# EAGLE design mainbrd (EAGLE 5.06)
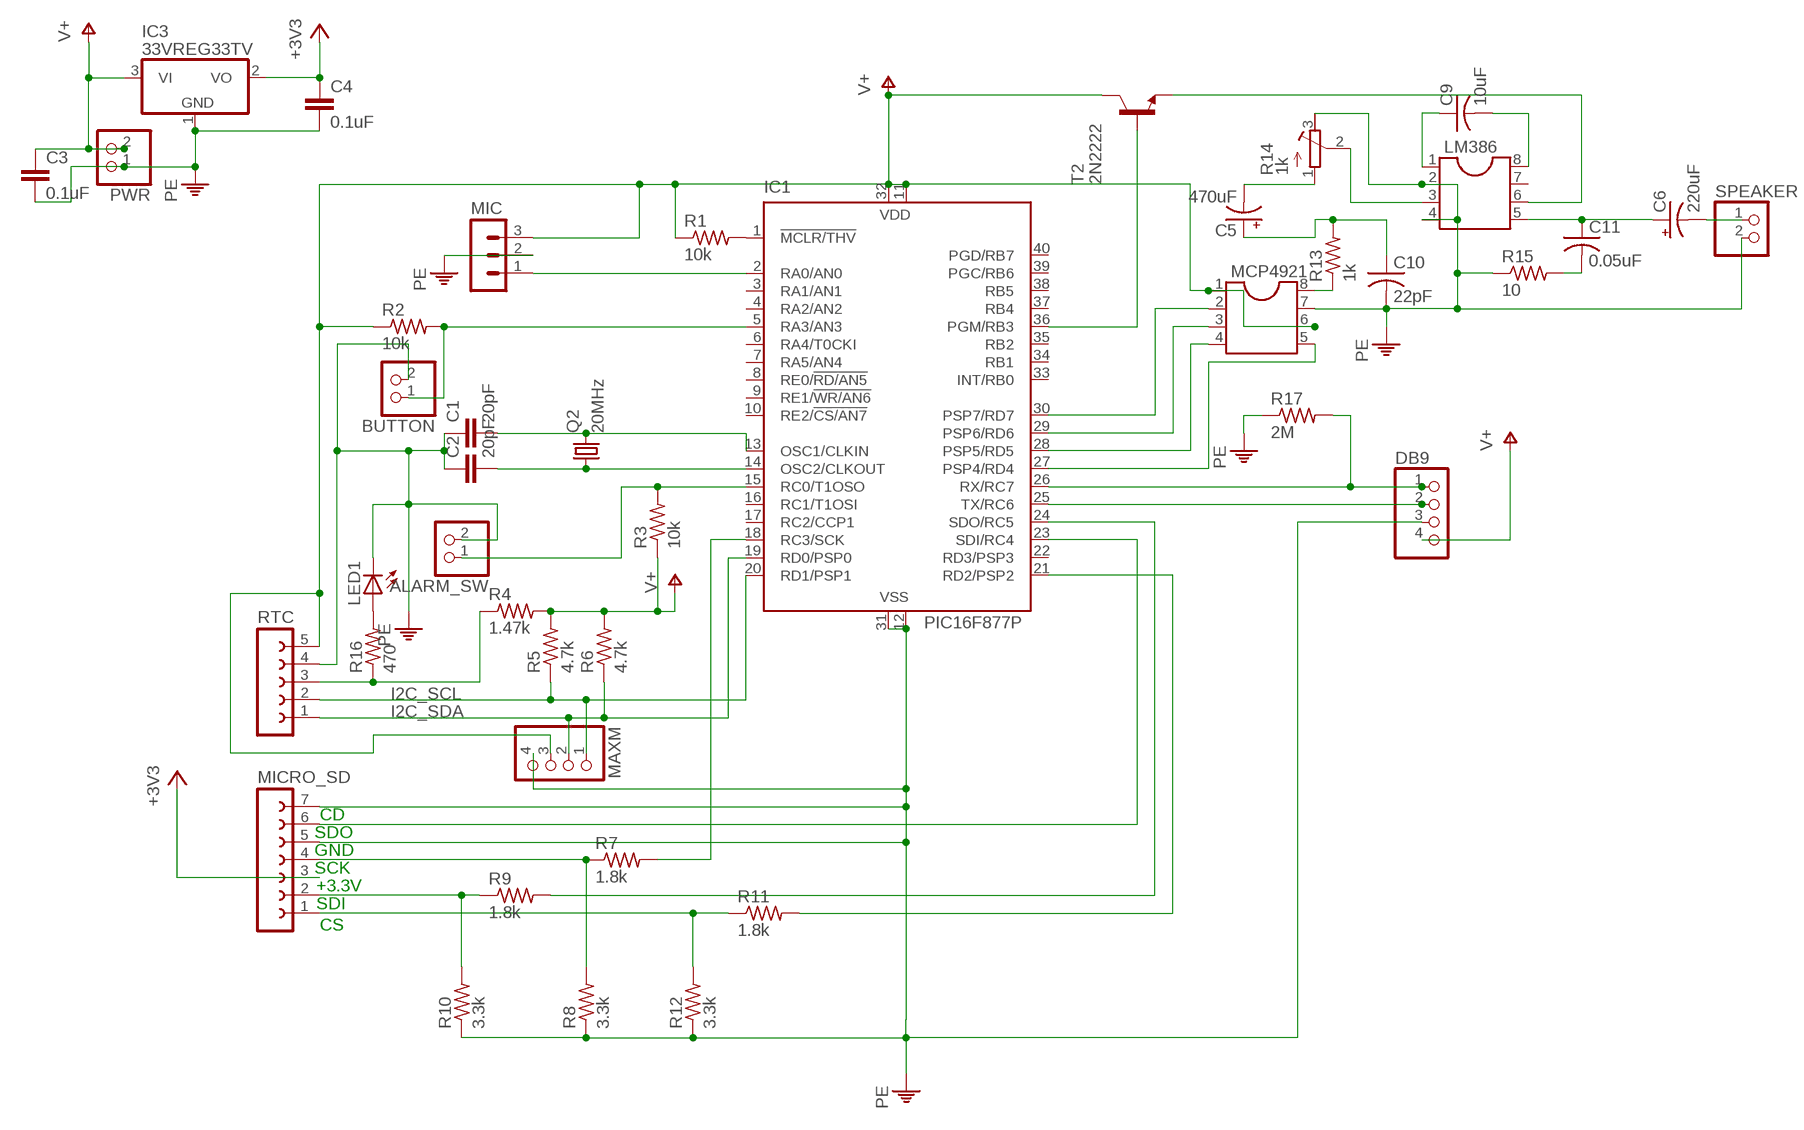
[diagram p0: schematic, sheet 1]

## Parts
ALARM_SW  PINHD-1X2  [1X02]
BUTTON  PINHD-1X2  [1X02]
C1  20pF  C5/2.5  [C5B2.5]
C2  20pF  C5/2.5  [C5B2.5]
C3  0.1uF  C-EU025-025X050  [C025-025X050]
C4  0.1uF  C5/2.5  [C5B2.5]
C5  470uF  CPOL-USB45181B  [B45181B]
C6  220uF  CPOL-USE5-10.5  [E5-10,5]
C9  10uF  C-US050-024X044  [C050-024X044]
C10  22pF  C-US025-025X050  [C025-025X050]
C11  0.05uF  C-US025-025X050  [C025-025X050]
DB9  PINHD-1X4  [1X04]
IC1  PIC16F877P  [DIL40]
IC3  33VREG33TV  [TO220V]
LED1  LED3MM  [LED3MM]
LM386  DIL8S  [SOCKET-08]
MAXM  PINHD-1X4  [1X04]
MCP4921  DIL8S  [SOCKET-08]
MIC  MA03-1  [MA03-1]
MICRO_SD  FE07-1  [FE07]
PWR  PINHD-1X2  [1X02]
Q2  20MHz  CRYSTALHC18U-V  [HC18U-V]
R1  10k  R-US_0204/7  [0204/7]
R2  10k  R-US_0204/7  [0204/7]
R3  10k  R-US_0204/7  [0204/7]
R4  1.47k  R-US_0204/7  [0204/7]
R5  4.7k  R-US_0204/7  [0204/7]
R6  4.7k  R-US_0204/7  [0204/7]
R7  1.8k  R-US_0204/7  [0204/7]
R8  3.3k  R-US_0204/7  [0204/7]
R9  1.8k  R-US_0204/7  [0204/7]
R10  3.3k  R-US_0204/7  [0204/7]
R11  1.8k  R-US_0204/7  [0204/7]
R12  3.3k  R-US_0204/7  [0204/7]
R13  1k  R-US_0204/7  [0204/7]
R14  1k  R-TRIMM64W  [RTRIM64W]
R15  10  R-US_0204/7  [0204/7]
R16  470  R-US_0204/7  [0204/7]
R17  2M  R-US_0204/7  [0204/7]
RTC  FE05-1  [FE05-1]
SPEAKER  PINHD-1X2  [1X02]
T2  2N2222  [TO18]

## Nets
+3V3: C4.1 IC3.2(VO) MICRO_SD.3
CS_3V: MICRO_SD.1 R11.1 R12.2
CS_5V: IC1.21(RD2/PSP2) R11.2
GND: ALARM_SW.2 BUTTON.2 C1.1 C2.1 C3.2 C4.2 DB9.3 IC1.12(VSS) IC1.31(VSS) IC3.1(GND) LED1.K(C) MAXM.4 MIC.2 MICRO_SD.5 MICRO_SD.7 PWR.1 R8.1 R10.1 R12.1 RTC.4 ; supply symbol labelled PE
I2C_SCL: IC1.20(RD1/PSP1) MAXM.1 R5.1 RTC.2
I2C_SDA: IC1.19(RD0/PSP0) MAXM.2 R6.1 RTC.1
N$1: IC1.1(!MCLR/THV) R1.2
N$2: R4.1 R16.1 RTC.3
N$3: IC1.27(PSP4/RD4) MCP4921.5
N$4: IC1.2(RA0/AN0) MIC.1
N$5: ALARM_SW.1 IC1.15(RC0/T1OSO) R3.2
N$6: BUTTON.1 IC1.5(RA3/AN3) R2.2
N$7: DB9.1 IC1.26(RX/RC7) R17.2
N$8: C1.2 IC1.13(OSC1/CLKIN) Q2.2
N$9: DB9.2 IC1.25(TX/RC6)
N$10: C2.2 IC1.14(OSC2/CLKOUT) Q2.1
N$12: C11.2 R15.2
N$17: C6.- SPEAKER.1
N$18: C5.- R14.1(E)
N$19: C9.1 LM386.1
N$20: LM386.3 R14.2(S)
N$21: LED1.A R16.2
N$22: LM386.6 T2.1(E)
N$23: MCP4921.8 R13.1
N$32: C9.2 LM386.8
N$33: C5.+ C10.1 R13.2
N$34: IC1.30(PSP7/RD7) MCP4921.2
N$35: IC1.29(PSP6/RD6) MCP4921.3
N$36: IC1.28(PSP5/RD5) MCP4921.4
N$39: IC1.36(PGM/RB3) T2.2(B)
N$42: C6.+ C11.1 LM386.5
PE: C10.2 LM386.2 LM386.4 MCP4921.7 R14.3(A) R15.1 R17.1 SPEAKER.2
SCK_3V: MICRO_SD.4 R7.1 R8.2
SCK_5V: IC1.18(RC3/SCK) R7.2
SDI_3V: MICRO_SD.2 R9.1 R10.2
SDI_5V: IC1.23(SDI/RC4) MICRO_SD.6
SDO_5V: IC1.24(SDO/RC5) R9.2
V+: C3.1 DB9.4 IC1.11(VDD) IC1.32(VDD) IC3.3(VI) MAXM.3 MCP4921.1 MCP4921.6 MIC.3 PWR.2 R1.1 R2.1 R3.1 R4.2 R5.2 R6.2 RTC.5 T2.3(C)
Unconnected: IC1.3(RA1/AN1) IC1.4(RA2/AN2) IC1.6(RA4/T0CKI) IC1.7(RA5/AN4) IC1.8(RE0/!RD/AN5) IC1.9(RE1/!WR/AN6) IC1.10(RE2/!CS/AN7) IC1.16(RC1/T1OSI) IC1.17(RC2/CCP1) IC1.22(RD3/PSP3) IC1.33(INT/RB0) IC1.34(RB1) IC1.35(RB2) IC1.37(RB4) IC1.38(RB5) IC1.39(PGC/RB6) IC1.40(PGD/RB7) LM386.7

## Notes on the sheet
- CD
- SDO
- GND
- SCK
- +3.3V
- SDI
- CS

## Library data of the parts
ALARM_SW BUTTON PWR SPEAKER = pinhead:PINHD-1X2: PIN HEADER
C1 C2 C4 = capacitor-wima:C: CAPACITOR naming: grid - package width
C3 = resistor:C-EU: CAPACITOR, European symbol
C5 C6 = resistor:CPOL-US: POLARIZED CAPACITOR, American symbol
C9 = resistor:C-US: CAPACITOR, American symbol
C10 C11 = rcl:C-US: CAPACITOR, American symbol
DB9 MAXM = pinhead:PINHD-1X4: PIN HEADER
IC1 = microchip:PIC16F87*: MICROCONTROLLER
IC3 = jorjs_parts:33VREG: 3.3v positive regulator LV33, as from SparkFun.com. Note the different pinout than the 78* series!
LED1 = led:LED: LED OSRAM: - CHIPLED LG R971, LG N971, LY N971, LG Q971, LY Q971, LO R971, LY R971 LH N974, LH R974 LS Q976, LO Q976, LY Q976 LO Q996 - Hyper CHIPLED LW Q18S LB Q993, LB Q99A, LB R99A - SideLED LS A670, LO A670, LY A670, LG A670, LP A670 LB A673, LV A673, LT A673, LW A673 LH A674 LY A675 LS A676, LA A676, LO A676, LY A676, LW A676 LS A679, LY A679, LG A679 - Hyper Micro SIDELED® LS Y876, LA Y876, LO Y876, LY Y876 LT Y87S - SmartLED LW L88C, LW L88S LB L89C, LB L89S, LG L890 LS L89K, LO L89K, LY L89K LS L896, LA L896, LO L896, LY L896 - TOPLED LS T670, LO T670, LY T670, LG T670, LP T670 LSG T670, LSP T670, LSY T670, LOP T670, LYG T670 LG T671, LOG T671, LSG T671 LB T673, LV T673, LT T673, LW T673 LH T674 LS T676, LA T676, LO T676, LY T676, LB T676, LH T676, LSB T676, LW T676 LB T67C, LV T67C, LT T67C, LS T67K, LO T67K, LY T67K, LW E67C LS E67B, LA E67B, LO E67B, LY E67B, LB E67C, LV E67C, LT E67C LW T67C LS T679, LY T679, LG T679 LS T770, LO T770, LY T770, LG T770, LP T770 LB T773, LV T773, LT T773, LW T773 LH T774 LS E675, LA E675, LY E675, LS T675 LS T776, LA T776, LO T776, LY T776, LB T776 LHGB T686 LT T68C, LB T68C - Hyper Mini TOPLED® LB M676 - Mini TOPLED Santana® LG M470 LS M47K, LO M47K, LY M47K Source: http://www.osram.convergy.de LUXEON: - LUMILED® LXK2-PW12-R00, LXK2-PW12-S00, LXK2-PW14-U00, LXK2-PW14-V00 LXK2-PM12-R00, LXK2-PM12-S00, LXK2-PM14-U00 LXK2-PE12-Q00, LXK2-PE12-R00, LXK2-PE12-S00, LXK2-PE14-T00, LXK2-PE14-U00 LXK2-PB12-K00, LXK2-PB12-L00, LXK2-PB12-M00, LXK2-PB14-N00, LXK2-PB14-P00, LXK2-PB14-Q00 LXK2-PR12-L00, LXK2-PR12-M00, LXK2-PR14-Q00, LXK2-PR14-R00 LXK2-PD12-Q00, LXK2-PD12-R00, LXK2-PD12-S00 LXK2-PH12-R00, LXK2-PH12-S00 LXK2-PL12-P00, LXK2-PL12-Q00, LXK2-PL12-R00 Source: www.luxeon.com KINGBRIGHT: KA-3528ASYC Source: www.kingbright.com
LM386 MCP4921 = ic-package:DIL8: Dual In Line / Socket
MIC = con-lstb:MA03-1: PIN HEADER
MICRO_SD = con-lsta:FE07-1: FEMALE HEADER
Q2 = crystal:CRYSTAL: CRYSTAL
R1-R13 R15-R17 = rcl:R-US_: RESISTOR, American symbol
R14 = rcl:R-TRIMM: Trimm resistor
RTC = con-lsta:FE05-1: FEMALE HEADER
T2 = transistor-neu-to92:2N2222: NPN TRANSISTOR

## Board
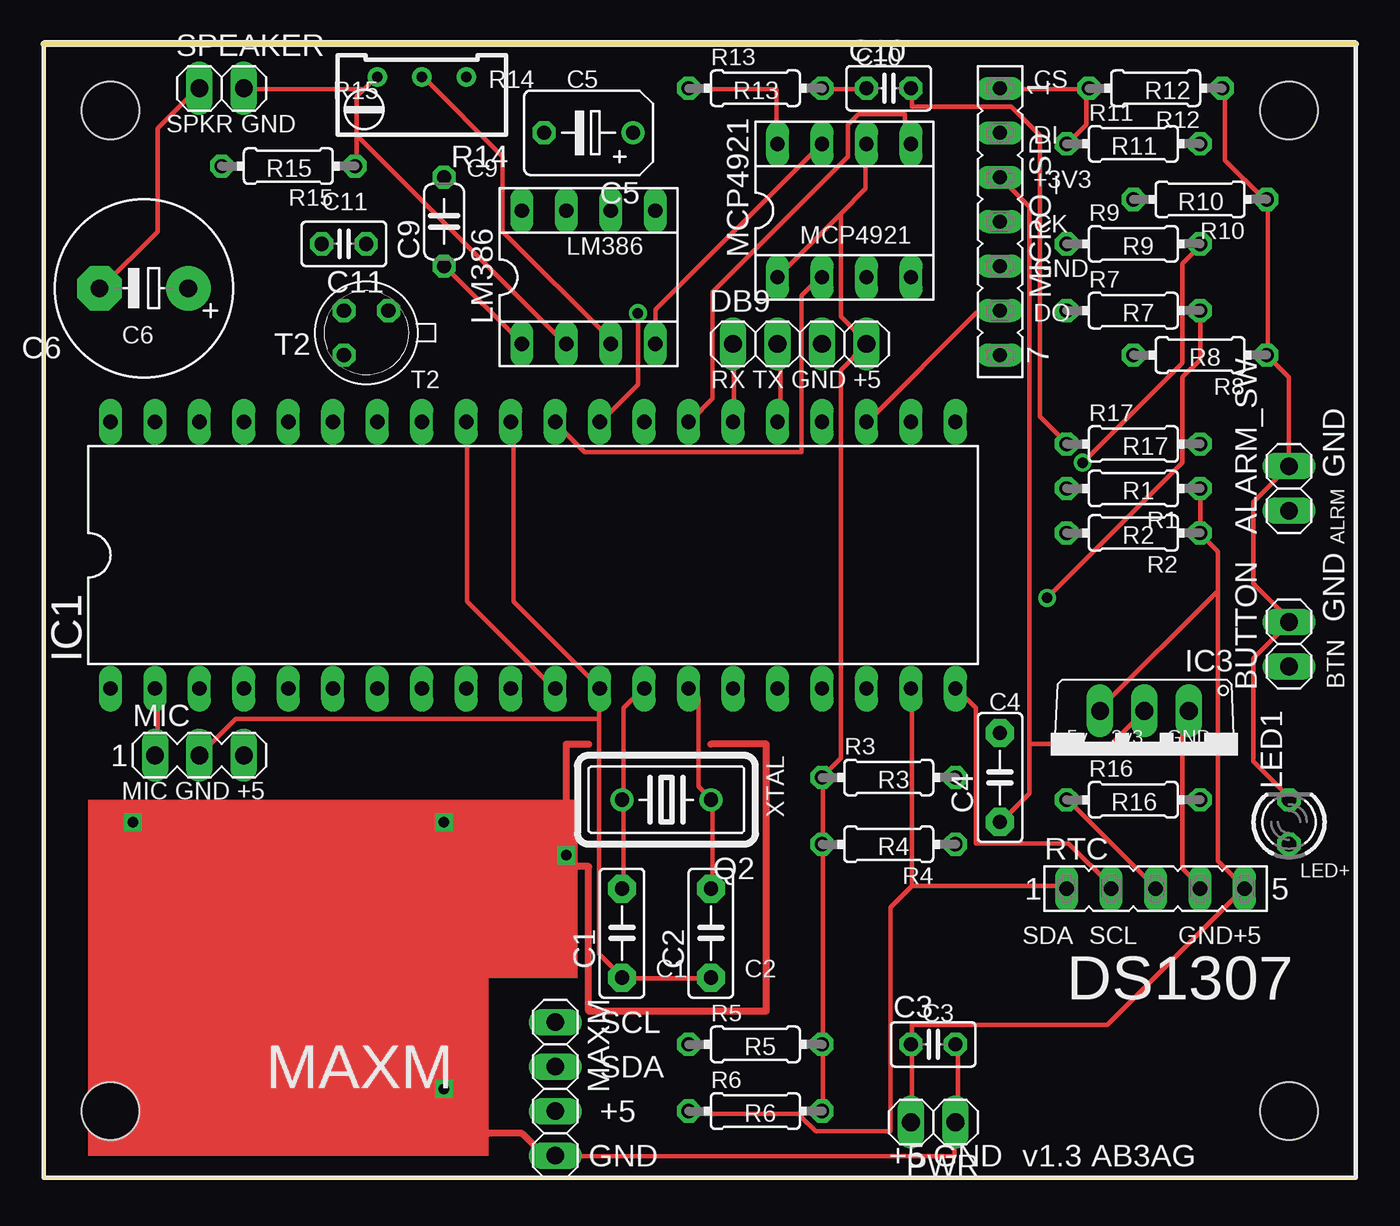
[diagram p1: board, top side]
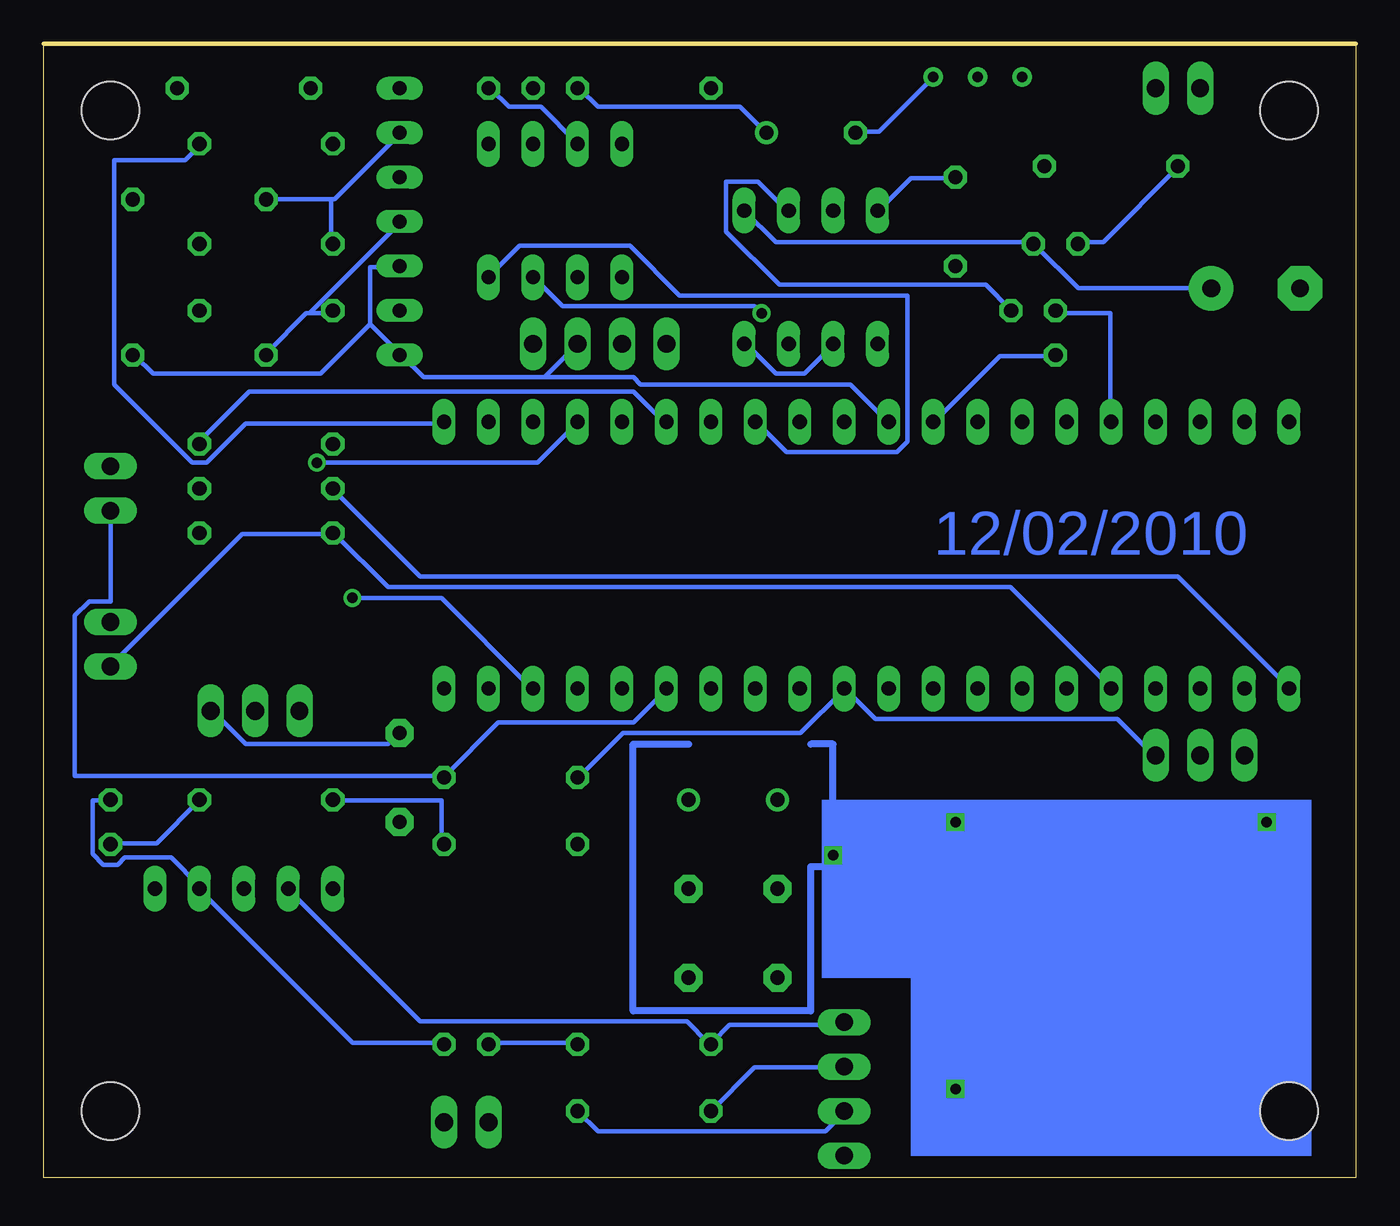
[diagram p2: board, bottom side, seen from below]

Size 74.93 x 64.77 mm. Coordinates in mm from the lower left corner, seen from the top.
Outline: 0,0 74.93,0 74.93,64.77 0,64.77 0,0
Copper layers (1*16): Top 0.035mm / dielectric 1.5mm / Bottom 0.035mm
Design rules "default": minimum track width 10mil, minimum drill 24mil, track to track 8mil, track to pad 8mil, pad to pad 8mil, via to via 8mil, smd to smd 8mil, copper to edge 40mil, drill to drill 8mil, minimum pad ring 10mil, minimum via ring 8mil, stop-mask expansion 4mil, vias tented up to drill 0mil, thermal gap 10mil

### Footprints (pad centres in the part's own frame; a part is rotated, then mirrored left to right if it is on the bottom)
1X02 = drill 1.016 long: 1 -1.27,0; 2 1.27,0
C5B2.5 = drill 0.813 pad 1.6 octagon: 1 -2.54,0; 2 2.54,0
C025-025X050 = drill 0.813 octagon: 1 -1.27,0; 2 1.27,0
B45181B = drill 0.813 round: + -2.54,0 | drill 0.813 octagon: - 2.54,0
E5-10,5 = drill 1.016 pad 2.54 round: + -2.54,0 | drill 1.016 pad 2.54 octagon: - 2.54,0
C050-024X044 = drill 0.813 octagon: 1 -2.54,0; 2 2.54,0
1X04 = drill 1.016 long: 1 -3.81,0; 2 -1.27,0; 3 1.27,0; 4 3.81,0
DIL40 = drill 0.813 long: 1 -24.13,-7.62; 2 -21.59,-7.62; 3 -19.05,-7.62; 4 -16.51,-7.62; 5 -13.97,-7.62; 6 -11.43,-7.62; 7 -8.89,-7.62; 8 -6.35,-7.62; 9 -3.81,-7.62; 10 -1.27,-7.62; 11 1.27,-7.62; 12 3.81,-7.62; 13 6.35,-7.62; 14 8.89,-7.62; 15 11.43,-7.62; 16 13.97,-7.62; 17 16.51,-7.62; 18 19.05,-7.62; 19 21.59,-7.62; 20 24.13,-7.62; 21 24.13,7.62; 22 21.59,7.62; 23 19.05,7.62; 24 16.51,7.62; 25 13.97,7.62; 26 11.43,7.62; 27 8.89,7.62; 28 6.35,7.62; 29 3.81,7.62; 30 1.27,7.62; 31 -1.27,7.62; 32 -3.81,7.62; 33 -6.35,7.62; 34 -8.89,7.62; 35 -11.43,7.62; 36 -13.97,7.62; 37 -16.51,7.62; 38 -19.05,7.62; 39 -21.59,7.62; 40 -24.13,7.62
TO220V = drill 1.016 long: 1 -2.54,-2.54; 2 0,-2.54; 3 2.54,-2.54
LED3MM = drill 0.813 octagon: A -1.27,0; K 1.27,0
SOCKET-08 = drill 0.813 long: 1 -3.81,-3.81; 2 -1.27,-3.81; 3 1.27,-3.81; 4 3.81,-3.81; 5 3.81,3.81; 6 1.27,3.81; 7 -1.27,3.81; 8 -3.81,3.81
MA03-1 = drill 1.016 long: 1 -2.54,0; 2 0,0; 3 2.54,0
FE07 = drill 0.813 long: 1 -7.62,0; 2 -5.08,0; 3 -2.54,0; 4 0,0; 5 2.54,0; 6 5.08,0; 7 7.62,0
HC18U-V = drill 0.813 round: 1 -2.54,0; 2 2.54,0
0204/7 = drill 0.813 octagon: 1 -3.81,0; 2 3.81,0
RTRIM64W = drill 0.61 round: 1 1.27,-2.54; 2 1.27,0; 3 1.27,2.54
FE05-1 = drill 0.813 long: 1 -5.08,0; 2 -2.54,0; 3 0,0; 4 2.54,0; 5 5.08,0
TO18 = drill 0.813 octagon: 1 -1.27,-1.27; 2 1.27,-1.27; 3 1.27,1.27
STAND-OFF = hole 3.302: 0,0

### Placement (x,y rotation side)
ALARM_SW  71.12,39.37 90 top
BUTTON  71.12,30.48 90 top
C1  33.02,13.97 90 top
C2  38.1,13.97 90 top
C3  50.8,7.62 0 top
C4  54.61,22.86 90 top
C5  31.11,59.69 180 top
C6  5.71,50.8 180 top
C9  22.86,54.61 90 top
C10  48.26,62.23 0 top
C11  17.14,53.34 180 top
DB9  43.18,47.62 0 top
IC1  27.94,35.56 0 top
IC3  62.87,24.13 180 top
LED1  71.12,20.32 90 top
LM386  31.11,51.44 0 top
MAXM  29.21,5.08 270 top
MCP4921  45.72,55.24 0 top
MIC  8.89,24.13 0 top
MICRO_SD  54.61,54.61 270 top
PWR  50.8,3.17 180 top
Q2  35.56,21.59 180 top
R1  62.23,39.37 180 top
R2  62.23,36.83 180 top
R3  48.26,22.86 0 top
R4  48.26,19.05 180 top
R5  40.64,7.62 0 top
R6  40.64,3.81 0 top
R7  62.23,49.53 0 top
R8  66.04,46.99 180 top
R9  62.23,53.34 0 top
R10  66.04,55.88 180 top
R11  62.23,59.05 0 top
R12  63.5,62.23 180 top
R13  40.64,62.23 0 top
R14  21.59,61.59 90 top
R15  13.97,57.78 180 top
R16  62.23,21.59 0 top
R17  62.23,41.91 0 top
RTC  63.5,16.51 0 top
SPEAKER  10.16,62.23 0 top
T2  18.41,48.26 180 top
U$1  [STAND-OFF]  71.12,3.81 0 top
U$2  [STAND-OFF]  3.81,3.81 0 top
U$3  [STAND-OFF]  3.81,60.96 0 top
U$4  [STAND-OFF]  71.12,60.96 0 top

### Tracks (layer width: path | path; a pad name or v marks a point on that pad's centre or on a via)
+3V3
  Top 0.254: 56.29,24.79 56.29,21.95 54.66,20.32 C4.1 | 56.29,24.79 56.29,55.47 MICRO_SD.3 | 56.29,24.79 60.96,24.79 62.79,26.62 IC3.2
CS_3V
  Top 0.254: 59.54,62.18 59.54,60.15 58.52,59.13 R11.1 | 59.54,62.18 54.66,62.18 MICRO_SD.1 | 59.54,62.18 R12.2
CS_5V
  Bottom 0.254: IC1.21 52.22,43.08 63.4,43.08 65.63,40.84 66.45,40.84 70.92,45.31 70.92,58.12 66.85,58.12 66.04,58.93 R11.2
GND
  Top 0.254: RTC.4 66.04,16.66 65.02,17.68 65.02,26.42 65.23,26.62 IC3.1 | C3.2 52.22,7.52 52.22,3.25 PWR.1 52.02,3.05 52.02,1.22 29.26,1.22 MAXM.4 | C2.1 38,11.38 33.12,11.38 C1.1 32.92,11.58 31.7,12.8 31.7,26.21 | IC1.31 26.82,43.08 26.82,32.92 31.7,28.04 IC1.12 31.7,27.84 31.7,26.21 | 31.7,26.21 10.97,26.21 MIC.2 | LED1.K 71.12,21.74 69.09,23.77 69.09,29.67 71.12,31.7 BUTTON.2 71.12,31.9 69.09,33.93 69.09,38.61 ALARM_SW.2 71.12,45.72 R8.1 69.9,47.14 69.9,55.88 R10.1 69.7,55.88 67.46,58.12 67.46,62.18 R12.1
  Bottom 0.254: C4.2 54.66,25.4 55.27,24.79 63.4,24.79 65.23,26.62 IC3.1 | C3.2 52.22,7.72 57.3,7.72 66.04,16.46 RTC.4 66.04,16.66 67.67,18.29 70.31,18.29 70.71,17.88 71.53,17.88 72.14,18.49 72.14,21.54 71.12,21.54 LED1.K | 56.29,48.77 54.66,47.14 MICRO_SD.7 54.46,46.94 53.24,45.72 46.33,45.72 | 56.29,48.77 56.29,52.02 54.66,52.02 MICRO_SD.5 | 46.33,45.72 44.5,47.55 DB9.3 | 56.29,48.77 59.13,45.92 68.68,45.92 69.7,46.94 R8.1 | 46.33,45.72 41.25,45.72 40.84,45.31 28.85,45.31 26.82,43.28 IC1.31
I2C_SCL
  Top 0.254: RTC.2 60.96,16.66 58.52,19.1 53.24,19.1 53.24,26.82 52.22,27.84 IC1.20
  Bottom 0.254: MAXM.1 29.26,8.74 35.76,8.74 36.78,7.72 R5.1 36.98,7.72 38.2,8.94 53.44,8.94 60.96,16.46 RTC.2
I2C_SDA
  Top 0.254: 49.58,16.66 58.32,16.66 RTC.1 | 49.58,16.66 49.58,27.84 IC1.19 | 49.58,16.66 48.36,15.44 48.36,2.64 44.09,2.64 43.28,3.45 43.28,3.66 36.98,3.66 R6.1
  Bottom 0.254: R6.1 34.34,6.3 29.26,6.3 MAXM.2
N$1
  Bottom 0.254: IC1.1 3.86,28.04 10.16,34.34 53.44,34.34 58.32,39.22 R1.2
N$2
  Top 0.254: RTC.3 63.4,16.66 58.52,21.54 R16.1
  Bottom 0.254: R4.1 52.22,19.1 52.22,21.54 58.32,21.54 R16.1
N$3
  Top 0.254: IC1.27 36.98,43.28 38.2,44.5 38.2,50.6 45.92,58.32 45.92,60.15 46.53,60.76 49.17,60.76 49.17,59.33 49.38,59.13 MCP4921.5
N$4
  Top 0.254: IC1.2 6.5,27.84 6.5,24.18 MIC.1
N$5
  Bottom 0.254: IC1.15 39.42,27.84 41.25,26.01 48.97,26.01 52.02,22.96 R3.2 52.22,22.96 73.15,22.96 73.15,32.11 72.34,32.92 71.12,32.92 ALARM_SW.1
N$6
  Bottom 0.254: IC1.5 14.02,28.04 19.71,33.73 55.27,33.73 58.32,36.78 R2.2 58.52,36.78 63.6,36.78 71.12,29.26 BUTTON.1
N$7
  Top 0.254: DB9.1 39.42,47.55 39.42,43.28 IC1.26
  Bottom 0.254: R17.2 66.04,42.06 63.2,44.91 41.25,44.91 39.62,43.28 39.42,43.28 IC1.26
N$8
  Top 0.254: C1.2 33.12,16.66 33.12,21.54 Q2.2 33.12,21.74 33.12,26.82 34.14,27.84 IC1.13
N$9
  Top 0.254: IC1.25 42.06,43.28 42.06,47.55 DB9.2
N$10
  Top 0.254: C2.2 38.2,16.66 38.2,21.54 Q2.1 38,21.74 37.39,22.35 37.39,27.43 36.98,27.84 IC1.14
N$12
  Bottom 0.254: R15.2 10.16,57.71 14.43,53.44 15.85,53.44 C11.2
N$13
  Top 0.406: 25.4,2.54 27.3,2.54 28.57,1.27
N$14  (via drill 0.6)
  other vias: 5.08,20.32
N$15  (via drill 0.6)
  other vias: 22.86,20.32
N$16  (via drill 0.6)
  other vias: 22.86,5.08
N$17
  Top 0.254: SPEAKER.1 8.74,62.18 6.5,59.94 6.5,54.05 3.25,50.8 C6.-
N$18
  Bottom 0.254: R14.1 24.18,62.79 27.23,59.74 28.45,59.74 C5.-
N$19
  Top 0.254: LM386.1 27.23,47.75 22.96,52.02 C9.1
N$20
  Top 0.254: R14.2 21.74,62.79 26.21,58.32 26.21,54.05 32.31,47.95 32.31,47.75 LM386.3
N$21
  Bottom 0.254: R16.2 66.04,21.54 68.48,19.1 71.12,19.1 LED1.A
N$22
  Bottom 0.254: T2.1 19.71,49.58 21.13,51 32.92,51 35.97,54.05 35.97,56.9 34.14,56.9 32.51,55.27 LM386.6
N$23
  Top 0.254: R13.1 36.98,62.18 41.86,62.18 41.86,59.13 MCP4921.8
N$25
  Top 0.406: 30.48,17.78 31.11,17.78 31.11,9.53 41.27,9.53 41.27,24.77 38.1,24.77
N$26
  Bottom 0.406: 29.84,17.78 31.11,17.78 31.11,9.53 41.27,9.53 41.27,24.77 38.1,24.77
N$27  (via drill 0.6)
  Top 0.406: 29.84,17.78 v29.84,18.41 29.84,24.77 31.11,24.77
  Bottom 0.406: 31.11,24.77 29.84,24.77 v29.84,18.41
N$32
  Bottom 0.254: LM386.8 27.23,55.27 25.4,57.1 22.96,57.1 C9.2
N$33
  Top 0.254: C10.1 46.94,62.18 44.5,62.18 R13.2
  Bottom 0.254: C5.+ 33.73,59.74 35.15,61.16 43.28,61.16 44.3,62.18 R13.2
N$34
  Top 0.254: IC1.30 29.26,43.08 30.89,41.45 43.28,41.45 43.28,50.39 44.3,51.41 MCP4921.2
N$35  (via drill 0.61)
  Top 0.254: v33.93,49.38 33.93,45.31 31.9,43.28 IC1.29
  Bottom 0.254: v33.93,49.38 34.34,49.78 45.31,49.78 46.94,51.41 MCP4921.3
N$36
  Bottom 0.254: IC1.28 34.14,43.08 32.51,41.45 26.21,41.45 25.6,42.06 25.6,50.39 38.61,50.39 41.45,53.24 47.75,53.24 49.38,51.61 MCP4921.4
N$39
  Bottom 0.254: IC1.36 14.02,43.28 14.02,49.38 17.07,49.38 T2.2
N$42
  Bottom 0.254: C6.+ 15.85,50.8 18.29,53.24 C11.1 18.49,53.44 33.12,53.44 LM386.5
PE
  Top 0.254: R17.1 58.32,42.06 56.9,43.48 56.9,59.54 55.27,61.16 49.58,61.16 49.58,62.18 C10.2 | 18.29,62.18 17.88,61.77 17.88,59.54 | 18.29,62.18 18.9,62.79 R14.3 | 17.88,59.54 17.88,57.91 R15.1 | 18.29,62.18 11.58,62.18 SPEAKER.2 | 17.88,59.54 29.67,47.75 LM386.2 | MCP4921.7 44.3,58.93 34.95,49.58 34.95,47.75 LM386.4
  Bottom 0.254: MCP4921.7 44.5,59.13 46.53,61.16 48.36,61.16 49.38,62.18 C10.2 | LM386.2 29.87,47.55 31.5,45.92 33.12,45.92 34.75,47.55 LM386.4
SCK_3V
  Bottom 0.254: 59.74,49.38 58.52,49.38 R7.1 | 59.74,49.38 59.94,49.38 62.18,47.14 R8.2 | 59.74,49.38 54.66,54.46 MICRO_SD.4
SCK_5V  (via drill 0.61)
  Top 0.254: v57.3,33.12 65.02,40.84 65.02,45.72 66.04,46.74 R7.2
  Bottom 0.254: v57.3,33.12 52.22,33.12 47.14,28.04 IC1.18
SDI_3V
  Bottom 0.254: 58.52,55.88 58.32,55.88 54.66,59.54 MICRO_SD.2 | 58.52,55.88 R10.2 | 58.52,55.88 58.52,53.44 R9.1
SDI_5V
  Top 0.254: IC1.23 47.14,43.28 53.24,49.38 54.46,49.38 MICRO_SD.6
SDO_5V  (via drill 0.61)
  Top 0.254: v59.33,40.84 65.02,46.53 65.02,52.22 66.04,53.24 R9.2
  Bottom 0.254: v59.33,40.84 46.74,40.84 44.5,43.08 IC1.24
V+
  Top 0.254: IC1.11 29.06,28.04 24.18,32.92 24.18,43.08 IC1.32 | R1.1 R2.1 66.04,36.78 67.06,35.76 67.06,33.53 | 67.06,33.53 67.06,18.09 68.48,16.66 RTC.5 68.48,16.46 60.76,8.74 49.58,8.74 49.58,7.72 C3.1 49.58,7.52 49.58,3.25 PWR.2 | 67.06,33.53 60.35,26.82 IC3.3 | 45.52,55.07 46.94,56.49 46.94,58.93 MCP4921.6 | 45.52,55.07 42.06,51.61 MCP4921.1 | 45.52,55.07 45.52,49.17 46.94,47.75 DB9.4 46.94,47.55 45.52,46.13 45.52,23.98 44.5,22.96 R3.1 44.5,22.76 44.5,19.1 R4.2 44.5,18.9 44.5,7.72 R5.2 44.5,7.52 44.5,3.86 R6.2
  Bottom 0.254: IC1.32 23.98,43.28 20.32,46.94 17.27,46.94 T2.3 | MIC.3 11.58,24.18 13.61,26.21 27.43,26.21 29.06,27.84 IC1.11 29.26,27.84 31.7,25.4 41.86,25.4 44.3,22.96 R3.1 | MAXM.3 29.26,3.66 30.28,2.64 43.28,2.64 R6.2 | C3.1 49.38,7.72 44.5,7.72 R5.2
(copper drawn outside any net)
  shapes: Bottom area x2, Top area x2

### Text on the board
Bottom: 12/02/2010
tPlace: C10 | R15 | R14 | C5 | R13 | CS | R12 | SPKR GND | DI | R11 | R15 | C9 | +3V3 | C11 | R10 | CK | LM386 | MCP4921 | R9 | GND | DO | R7 | C6 | R8 | T2 | RX TX GND +5 | R17 | GND | R1 | R2 | ALRM | GND | BTN | C4 | 5v | 3v3 | GND | XTAL | MIC GND +5 | R3 | R16 | R4 | LED+ | SDA | SCL | GND | +5 | C1 | C2 | DS1307 | C3 | SCL | R5 | SDA | MAXM | +5 | R6 | GND | +5 | GND | v1.3 AB3AG